# Altium schematic sheet Battery.SchDoc
size A4
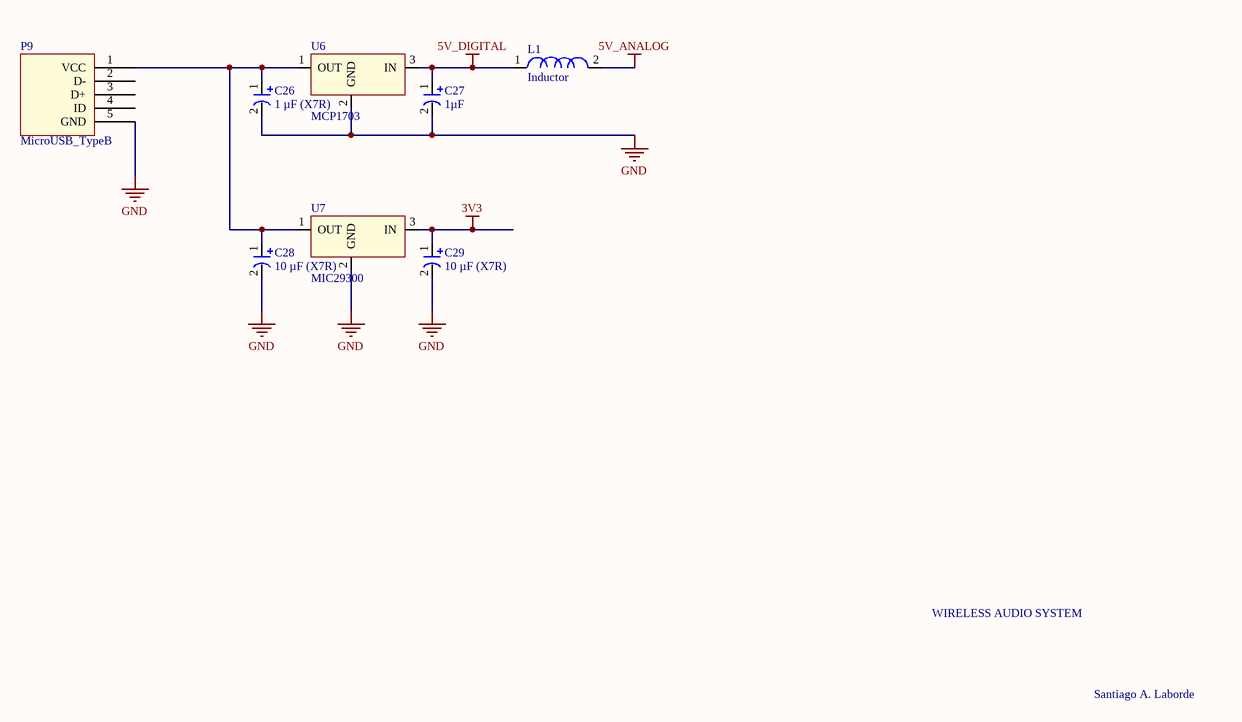
[diagram p0: Battery.SchDoc]

## Parts
C26  1 µF (X7R)  [RAD-0.1]
C27  1µF  [RAD-0.1]
C28  10 µF (X7R)  [RAD-0.1]
C29  10 µF (X7R)  [RAD-0.1]
L1  Inductor  [R_0805]
P9  MicroUSB_TypeB  [*TE_2013499-1]
U6  MCP1703  [SOT-223-3]
U7  MIC29300  [TO-263-3]

## Nets
3V3: C29.1 U7.3(IN)
5V_ANALOG: L1.2
5V_DIGITAL: C27.1 L1.1 U6.3(IN)
GND: C26.2 C27.2 C28.2 C29.2 P9.5(GND) U6.2(GND) U7.2(GND)
NetC26_1: C26.1 C28.1 P9.1(VCC) U6.1(OUT) U7.1(OUT)

Not connected (* = marked no-connect by the designer): P9 2(D-) 3(D+) 4(ID)

## Notes on the sheet
- WIRELESS AUDIO SYSTEM
- Santiago A. Laborde

## Library data of the parts
C26-C29 = Capacitor_Pol: Polarysed Capacitor
U6 = MCP1703: low dropout positive voltage regulators that / are capable of providing an output current that is in excess of 1.0 A / with a maximum dropout voltage of 1.2 V at 800 mA over / temperature. This series contains nine fixed output voltages of 1.5 V, / 1.8 V, 1.9 V, 2.0 V, 2.5 V, 2.85 V, 3.3 V, 5.0 V, and 12 V that have no / minimum load requirement to maintain regulation
U7 = MIC29300: low dropout positive voltage regulators that / are capable of providing an output current that is in excess of 1.0 A / with a maximum dropout voltage of 1.2 V at 800 mA over / temperature. This series contains nine fixed output voltages of 1.5 V, / 1.8 V, 1.9 V, 2.0 V, 2.5 V, 2.85 V, 3.3 V, 5.0 V, and 12 V that have no / minimum load requirement to maintain regulation